# Altium schematic sheet senror_input.SchDoc
size A3
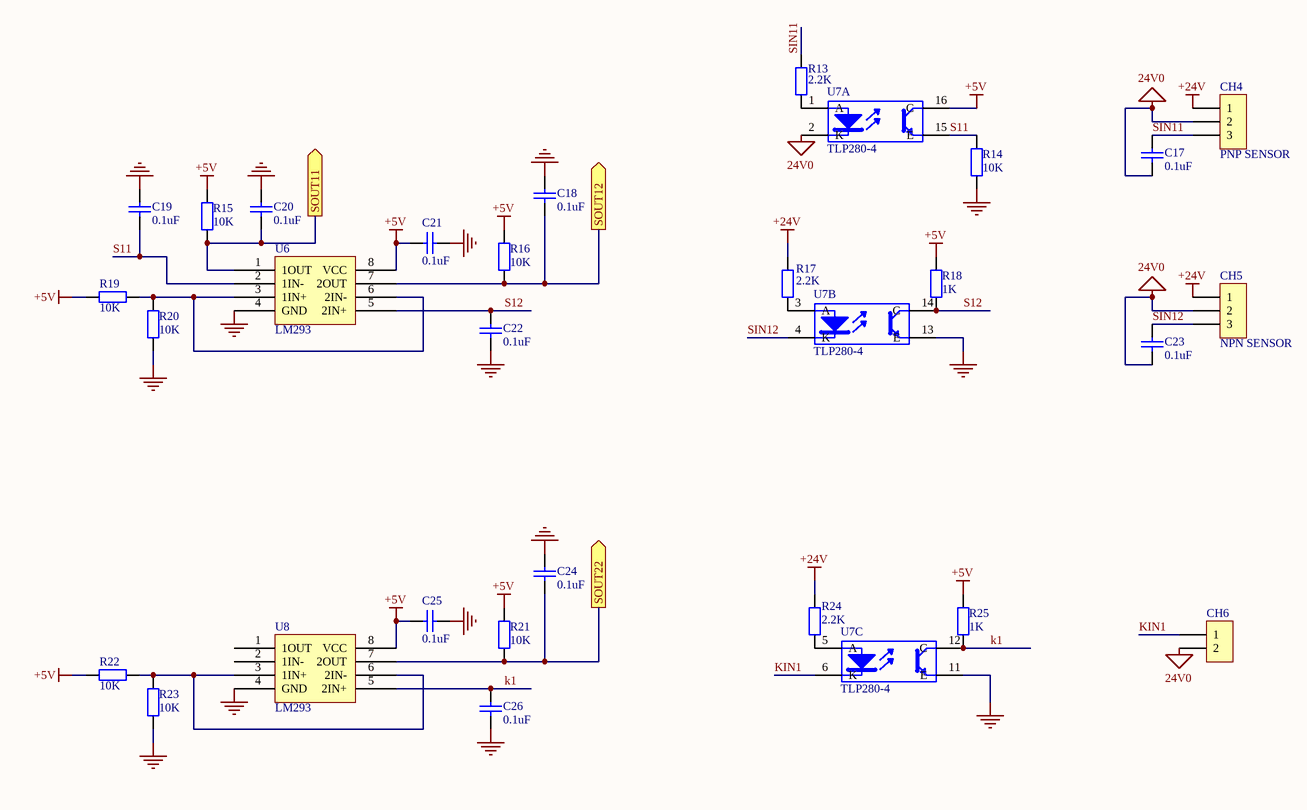
[diagram p0: senror_input.SchDoc]

## Parts
C17  value 0.1uF  [0805]  (hidden comment: Cap)
C18  value 0.1uF  [0805]  (hidden comment: Cap)
C19  value 0.1uF  [0805]  (hidden comment: Cap)
C20  value 0.1uF  [0805]  (hidden comment: Cap)
C21  value 0.1uF  [0805]  (hidden comment: Cap)
C22  value 0.1uF  [0805]  (hidden comment: Cap)
C23  value 0.1uF  [0805]  (hidden comment: Cap)
C24  value 0.1uF  [0805]  (hidden comment: Cap)
C25  value 0.1uF  [0805]  (hidden comment: Cap)
C26  value 0.1uF  [0805]  (hidden comment: Cap)
CH4  HEADER1X3  [CH3.96-3PIN]  (value not drawn)
CH5  HEADER1X3  [CH3.96-3PIN]  (value not drawn)
CH6  HEADER1X2  [CH3.96-2PIN]  (value not drawn)
R13  value 2.2K  [0805]  (hidden comment: Res2)
R14  value 10K  [0805]  (hidden comment: Res2)
R15  value 10K  [0805]  (hidden comment: Res2)
R16  value 10K  [0805]  (hidden comment: Res2)
R17  value 2.2K  [0805]  (hidden comment: Res2)
R18  value 1K  [0805]  (hidden comment: Res2)
R19  value 10K  [0805]  (hidden comment: Res2)
R20  value 10K  [0805]  (hidden comment: Res2)
R21  value 10K  [0805]  (hidden comment: Res2)
R22  value 10K  [0805]  (hidden comment: Res2)
R23  value 10K  [0805]  (hidden comment: Res2)
R24  value 2.2K  [0805]  (hidden comment: Res2)
R25  value 1K  [0805]  (hidden comment: Res2)
U6  LM293  [SOP8-OP27]
U7  TLP280-4  [SO16]  (parts A,B,C of 4)
U8  LM293  [SOP8-OP27]

## Ports
SOUT11 (out), SOUT12 (out), SOUT22 (out)

## Nets
24V0: C17.2 C23.2 CH4.2 CH5.2 CH6.2 U7.2(K)
+5V: C21.2 C25.2 R15.1 R16.1 R18.1 R19.1 R21.1 R22.1 R25.1 U6.8(VCC) U7.16(C) U8.8(VCC)
+24V: CH4.1 CH5.1 R17.1 R24.1
GND: C18.1 C19.1 C20.1 C21.1 C22.1 C24.1 C25.1 C26.1 R14.2 R20.2 R23.2 U6.4(GND) U7.11(E) U7.13(E) U8.4(GND)
k1: C26.2 R25.2 U7.12(C) U8.5(2IN+)
KIN1: CH6.1 U7.6(K)
S11: C19.2 R14.1 U6.2(1IN-) U7.15(E)
S12: C22.2 R18.2 U6.5(2IN+) U7.14(C)
SIN11: C17.1 CH4.3 R13.1
SIN12: C23.1 CH5.3 U7.4(K)
SOUT11: C20.2 R15.2 U6.1(1OUT) ; port SOUT11
SOUT12: C18.2 R16.2 U6.7(2OUT) ; port SOUT12
SOUT22: C24.2 R21.2 U8.7(2OUT) ; port SOUT22
NetR13_2: R13.2 U7.1(A)
NetR17_2: R17.2 U7.3(A)
NetR19_2: R19.2 R20.1 U6.3(1IN+) U6.6(2IN-)
NetR22_2: R22.2 R23.1 U8.3(1IN+) U8.6(2IN-)
NetR24_2: R24.2 U7.5(A)

Not connected (* = marked no-connect by the designer): U8 1(1OUT) 2(1IN-)

## Notes on the sheet
- (in symbol HEADER1X3) PNP SENSOR; NPN SENSOR

## Library data of the parts
C17-C26 = Cap: Capacitor; Published: 8-Jun-2000; LatestRevisionDate: 17-Jul-2002; LatestRevisionNote: Re-released for DXP Platform.; PackageReference: RAD-0.3; Publisher: Altium Limited
R13-R25 = Res2: Resistor; Published: 8-Jun-2000; LatestRevisionDate: 17-Jul-2002; LatestRevisionNote: Re-released for DXP Platform.; PackageReference: AXIAL-0.4; Publisher: Altium Limited
U7 = TLP521-4